# Altium schematic sheet EMG_biofedback.SchDoc
size A4
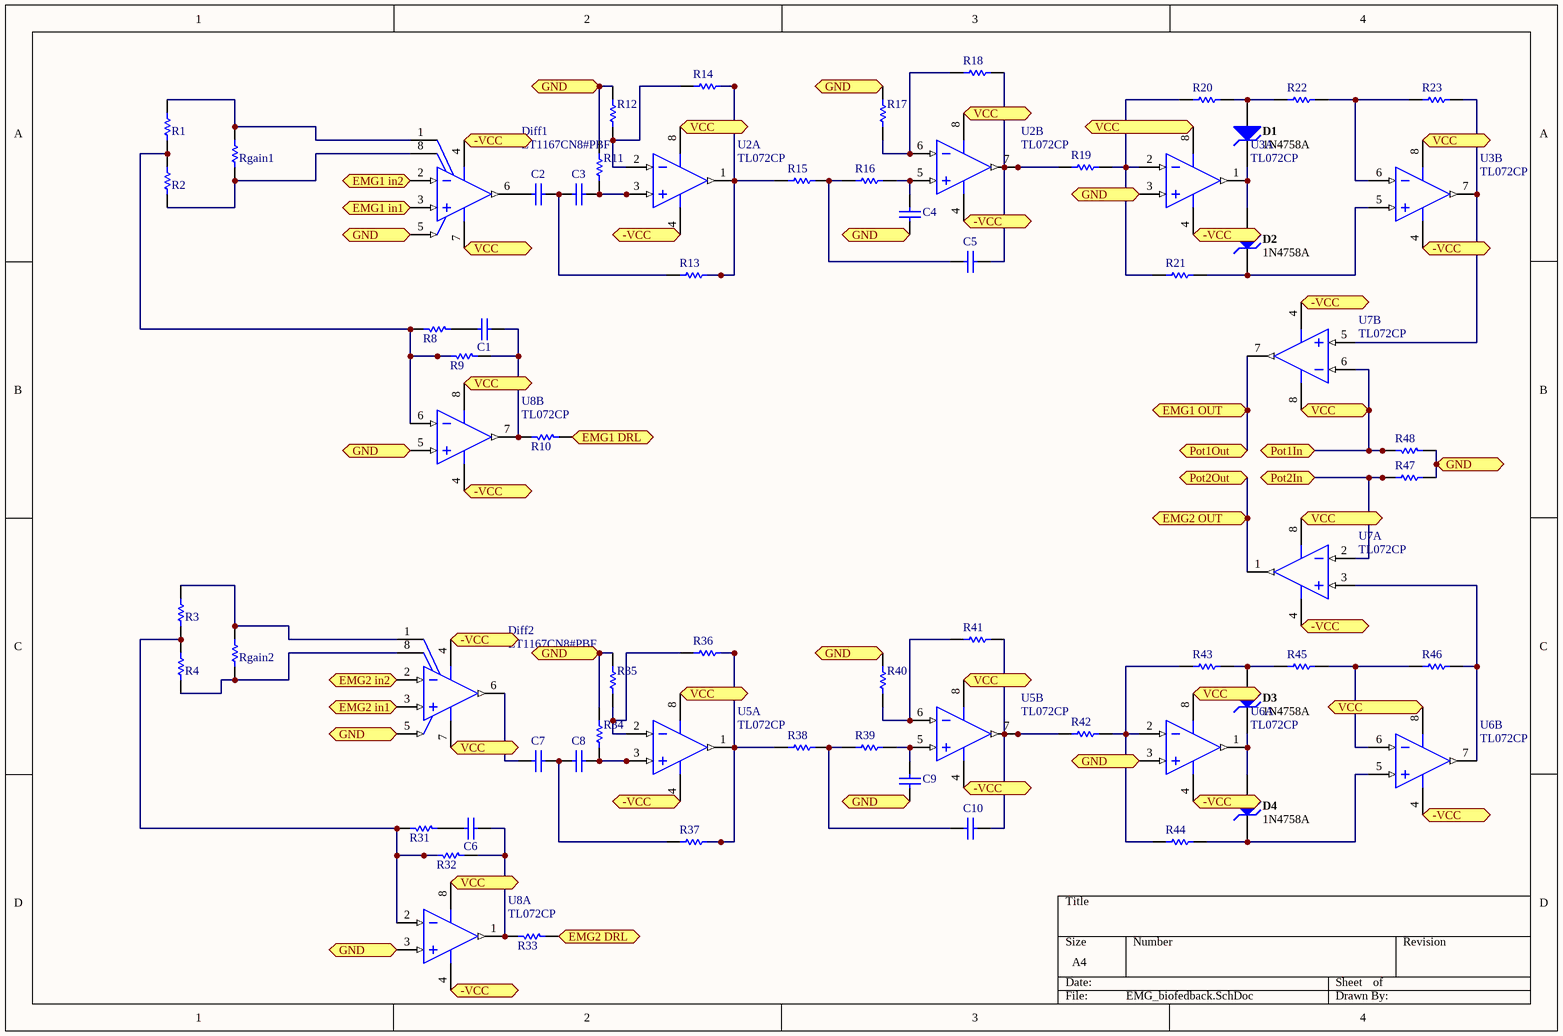
[diagram p0: EMG_biofedback.SchDoc]

## Parts
C1  CAP 10nF 50V 0805(2012)  [CAPC0805(2012)100_M]  (value not drawn)
C2  CAP 1uF 50V 0805(2012)  [CAPC0805(2012)145_L]  (value not drawn)
C3  CAP 1uF 50V 0805(2012)  [CAPC0805(2012)145_L]  (value not drawn)
C4  CAP 47nF 50V 0805(2012)  [CAPC0805(2012)145_M]  (value not drawn)
C5  CAP 4.7nF 50V 0805(2012)  [CAPC0805(2012)110_M]  (value not drawn)
C6  CAP 10nF 50V 0805(2012)  [CAPC0805(2012)100_M]  (value not drawn)
C7  CAP 1uF 50V 0805(2012)  [CAPC0805(2012)145_L]  (value not drawn)
C8  CAP 1uF 50V 0805(2012)  [CAPC0805(2012)145_L]  (value not drawn)
C9  CAP 47nF 50V 0805(2012)  [CAPC0805(2012)145_M]  (value not drawn)
C10  CAP 4.7nF 50V 0805(2012)  [CAPC0805(2012)110_M]  (value not drawn)
D1  1N4758A  [FAIR-DO-41-2_V]
D2  1N4758A  [FAIR-DO-41-2_V]
D3  1N4758A  [FAIR-DO-41-2_V]
D4  1N4758A  [FAIR-DO-41-2_V]
Diff1  LT1167CN8#PBF  [LT-N8-8]
Diff2  LT1167CN8#PBF  [LT-N8-8]
R1  30K 5% 0805(2012)  [RESC0805(2012)_M]  (value not drawn)
R2  30K 5% 0805(2012)  [RESC0805(2012)_M]  (value not drawn)
R3  30K 5% 0805(2012)  [RESC0805(2012)_M]  (value not drawn)
R4  30K 5% 0805(2012)  [RESC0805(2012)_M]  (value not drawn)
R8  12K 5% 0805(2012)  [RESC0805(2012)_N]  (value not drawn)
R9  1M 5% 0805(2012)  [RESC0805(2012)_L]  (value not drawn)
R10  1M 5% 0805(2012)  [RESC0805(2012)_L]  (value not drawn)
R11  6K2 5% 0805(2012)  [RESC0805(2012)_L]  (value not drawn)
R12  20K 5% 0805(2012)  [RESC0805(2012)_L]  (value not drawn)
R13  43K 5% 0805(2012)  [RESC0805(2012)_N]  (value not drawn)
R14  180K 5% 0805(2012)  [RESC0805(2012)_N]  (value not drawn)
R15  51K 5% 0805(2012)  [RESC0805(2012)_L]  (value not drawn)
R16  9K1 5% 0805(2012)  [RESC0805(2012)_M]  (value not drawn)
R17  20K 5% 0805(2012)  [RESC0805(2012)_L]  (value not drawn)
R18  180K 5% 0805(2012)  [RESC0805(2012)_N]  (value not drawn)
R19  10K 5% 0805(2012)  [RESC0805(2012)_L]  (value not drawn)
R20  10K 5% 0805(2012)  [RESC0805(2012)_L]  (value not drawn)
R21  10K 5% 0805(2012)  [RESC0805(2012)_L]  (value not drawn)
R22  10K 5% 0805(2012)  [RESC0805(2012)_L]  (value not drawn)
R23  10K 5% 0805(2012)  [RESC0805(2012)_L]  (value not drawn)
R31  12K 5% 0805(2012)  [RESC0805(2012)_N]  (value not drawn)
R32  1M 5% 0805(2012)  [RESC0805(2012)_L]  (value not drawn)
R33  1M 5% 0805(2012)  [RESC0805(2012)_L]  (value not drawn)
R34  6K2 5% 0805(2012)  [RESC0805(2012)_L]  (value not drawn)
R35  20K 5% 0805(2012)  [RESC0805(2012)_L]  (value not drawn)
R36  180K 5% 0805(2012)  [RESC0805(2012)_N]  (value not drawn)
R37  43K 5% 0805(2012)  [RESC0805(2012)_N]  (value not drawn)
R38  51K 5% 0805(2012)  [RESC0805(2012)_L]  (value not drawn)
R39  9K1 5% 0805(2012)  [RESC0805(2012)_M]  (value not drawn)
R40  20K 5% 0805(2012)  [RESC0805(2012)_L]  (value not drawn)
R41  180K 5% 0805(2012)  [RESC0805(2012)_N]  (value not drawn)
R42  10K 5% 0805(2012)  [RESC0805(2012)_L]  (value not drawn)
R43  10K 5% 0805(2012)  [RESC0805(2012)_L]  (value not drawn)
R44  10K 5% 0805(2012)  [RESC0805(2012)_L]  (value not drawn)
R45  10K 5% 0805(2012)  [RESC0805(2012)_L]  (value not drawn)
R46  10K 5% 0805(2012)  [RESC0805(2012)_L]  (value not drawn)
R47  10K 5% 0805(2012)  [RESC0805(2012)_L]  (value not drawn)
R48  10K 5% 0805(2012)  [RESC0805(2012)_L]  (value not drawn)
Rgain1  6K2 5% 0805(2012)  [RESC0805(2012)_L]  (value not drawn)
Rgain2  6K2 5% 0805(2012)  [RESC0805(2012)_L]  (value not drawn)
U2  TL072CP  [TI-P8]  (parts A,B of 2)
U3  TL072CP  [TI-P8]  (parts A,B of 2)
U5  TL072CP  [TI-P8]  (parts A,B of 2)
U6  TL072CP  [TI-P8]  (parts A,B of 2)
U7  TL072CP  [TI-P8]  (parts A,B of 2)
U8  TL072CP  [TI-P8]  (parts A,B of 2)

## Ports
-VCC, EMG1 DRL, EMG1 in1, EMG1 in2, EMG1 OUT, EMG2 DRL, EMG2 in1, EMG2 in2, EMG2 OUT, GND, Pot1In, Pot1Out, Pot2In, Pot2Out, VCC

## Nets
-VCC: Diff1.4(-VS) Diff2.4(-VS) U2.4(VCC-) U3.4(VCC-) U5.4(VCC-) U6.4(VCC-) U7.4(VCC-) U8.4(VCC-) ; port -VCC
EMG1 DRL: R10.1 ; port EMG1 DRL
EMG1 in1: Diff1.3(+IN) ; port EMG1 in1
EMG1 in2: Diff1.2(-IN) ; port EMG1 in2
EMG1 OUT: U7.7(OUT2) ; port EMG1 OUT, port Pot1Out
EMG2 DRL: R33.1 ; port EMG2 DRL
EMG2 in1: Diff2.3(+IN) ; port EMG2 in1
EMG2 in2: Diff2.2(-IN) ; port EMG2 in2
EMG2 OUT: U7.1(OUT1) ; port EMG2 OUT, port Pot2Out
GND: C4.1 C9.1 Diff1.5(REF) Diff2.5(REF) R11.1 R12.2 R17.2 R34.1 R35.2 R40.2 R47.2 R48.2 U3.3(IN1+) U6.3(IN1+) U8.3(IN1+) U8.5(IN2+) ; port GND
Pot1In: Diff1.7(+VS) Diff2.7(+VS) R48.1 U2.8(VCC+) U3.8(VCC+) U5.8(VCC+) U6.8(VCC+) U7.6(IN2-) U7.8(VCC+) U8.8(VCC+) ; port Pot1In, port VCC
Pot2In: R47.1 U7.2(IN1-) ; port Pot2In
NetC1_1: C1.1 R9.1 R10.2 U8.7(OUT2)
NetC1_2: C1.2 R8.2
NetC2_1: C2.1 Diff1.6(OUTPUT)
NetC2_2: C2.2 C3.1 R13.1
NetC3_2: C3.2 R11.2 U2.3(IN1+)
NetC4_2: C4.2 R16.2 U2.5(IN2+)
NetC5_1: C5.1 R15.2 R16.1
NetC5_2: C5.2 R18.2 R19.1 U2.7(OUT2)
NetC6_1: C6.1 R32.1 R33.2 U8.1(OUT1)
NetC6_2: C6.2 R31.2
NetC7_1: C7.1 Diff2.6(OUTPUT)
NetC7_2: C7.2 C8.1 R37.1
NetC8_2: C8.2 R34.2 U5.3(IN1+)
NetC9_2: C9.2 R39.2 U5.5(IN2+)
NetC10_1: C10.1 R38.2 R39.1
NetC10_2: C10.2 R41.2 R42.1 U5.7(OUT2)
NetD1_1: D1.1(A) R20.2 R22.1
NetD1_2: D1.2(K) D2.1(A) U3.1(OUT1)
NetD2_2: D2.2(K) R21.2 U3.5(IN2+)
NetD3_1: D3.1(A) R43.2 R45.1
NetD3_2: D3.2(K) D4.1(A) U6.1(OUT1)
NetD4_2: D4.2(K) R44.2 U6.5(IN2+)
NetDiff1_1: Diff1.1(RG) R1.2 Rgain1.2
NetDiff1_8: Diff1.8(RG) R2.1 Rgain1.1
NetDiff2_1: Diff2.1(RG) R3.2 Rgain2.2
NetDiff2_8: Diff2.8(RG) R4.1 Rgain2.1
NetR1_1: R1.1 R2.2 R8.1 R9.2 U8.6(IN2-)
NetR3_1: R3.1 R4.2 R31.1 R32.2 U8.2(IN1-)
NetR12_1: R12.1 R14.1 U2.2(IN1-)
NetR13_2: R13.2 R14.2 R15.1 U2.1(OUT1)
NetR17_1: R17.1 R18.1 U2.6(IN2-)
NetR19_2: R19.2 R20.1 R21.1 U3.2(IN1-)
NetR22_2: R22.2 R23.1 U3.6(IN2-)
NetR23_2: R23.2 U3.7(OUT2) U7.5(IN2+)
NetR35_1: R35.1 R36.1 U5.2(IN1-)
NetR36_2: R36.2 R37.2 R38.1 U5.1(OUT1)
NetR40_1: R40.1 R41.1 U5.6(IN2-)
NetR42_2: R42.2 R43.1 R44.1 U6.2(IN1-)
NetR45_2: R45.2 R46.1 U6.6(IN2-)
NetR46_2: R46.2 U6.7(OUT2) U7.3(IN1+)

## Library data of the parts
C1 C6 = CMP-1036-03837-1: CAP 10nF 50V ±1% 0805 (2012 Metric) Thickness 1mm SMD; Case-Metric: 2012; Case-EIA: 0805; Tolerance: ±1%; Rated Voltage: 50 V; Value: 10nF; Max Thickness: 1 mm; Technology: SMT
C2 C3 C7 C8 = CMP-1036-04761-1: CAP 1uF 50V ±10% 0805 (2012 Metric) Thickness 1.45mm SMD; Case-EIA: 0805; Case-Metric: 2012; Technology: SMT; Tolerance: ±10%; Value: 1uF; Max Thickness: 1.45 mm; Rated Voltage: 50 V
C4 C9 = CMP-1036-04255-1: CAP 47nF 50V ±5% 0805 (2012 Metric) Thickness 1.45mm SMD; Case-EIA: 0805; Case-Metric: 2012; Max Thickness: 1.45 mm; Rated Voltage: 50 V; Tolerance: ±5%; Technology: SMT; Value: 47nF
C5 C10 = CMP-1036-03592-1: CAP 4.7nF 50V ±10% 0805 (2012 Metric) Thickness 1.1mm SMD; Case-Metric: 2012; Case-EIA: 0805; Max Thickness: 1.1 mm; Value: 4.7nF; Tolerance: ±10%; Rated Voltage: 50 V; Technology: SMT
D1-D4 = CMP-0892-00017-1: Zener Diode, 56V, 1W, 5%, -65 to 200 degC, 2-Pin DO-41, Body 2.72 x 5.2 mm, RoHS; Manufacturer: Fairchild Semiconductor; IR (uA): 5; VZ (Max.) (V): 58.8; VZ (Min.) (V): 53.2; PD (W): 1; ZZ (Max) (ohm): 110; Test Current IZ (mA): 4.5; PartNumber: 1N4758A; Tolerance: 5%; Mounting Technology: Through Hole; ComponentLink2URL: http://www.fairchildsemi.com/ds/1N/1N4744A.pdf; ComponentLink2Description: Datasheet; PackageDescription: 2-Pin Axial leaded, Body 2.72 x 5.2 mm, Lead Spread 25.4 mm; PackageVersion: Rev. 2; ComponentLink3Description: Package Specification; RoHS: TRUE; ComponentLink1Description: Manufacturer URL; DatasheetVersion: Rev. H3; ComponentLink1URL: http://www.fairchildsemi.com/; ComponentLink3URL: http://www.fairchildsemi.com/dwg/DO/DO41A.pdf; Operating and Storage Temperature Range: -65 to 200 degC; PackageReference: DO-41-2
Diff1 Diff2 = CMP-0359-01174-1: Single Channel, Precision Operational Amplifier, Low Bias Current IA, 1 MHz Typical GBW, 1.2 V/us Typical SR, 4.6 to 40 V, 8-Pin DIP (N8-8), Commercial, Pb-Free; Manufacturer: Linear Technology; Linear Technology Part Number: LT1167; GBW (MHz) Typical: 1; Vs Min (V): 4.6; Is (mA) Typical: 0.9; Vos (mV) Typical: 0.015; SR (V/us) Typical: 1.2; Vs Max (V): 40; Mounting Technology: Surface Mount; ComponentLink1Description: Datasheet; Type: IA; ComponentLink1URL: http://cds.linear.com/docs/Datasheet/1167fc.pdf; PackageVersion: Rev I; ComponentLink2Description: Package Specification; PackageDescription: 8-Lead PDIP, Body 10.16 x 6.48 mm, Pitch 2.54 mm; RoHS: Pb-Free; ComponentLink2URL: http://cds.linear.com/docs/Packaging/05081510_I_N8.pdf; PartNumber: LT1167CN8#PBF; Channels (#): 1; DatasheetVersion: Rev. C; PackageReference: LT-N8-8
R1-R4 = CMP-1013-00109-1: 30K 0.125W 5% 0805 (2012 Metric)  SMD; Case-EIA: 0805; Case-Metric: 2012; Value: 30000.00 Ohm; Tolerance: 5 %; Technology: SMT; Power: 0.125 W
R8 R31 = CMP-1013-00100-1: 12K 0.125W 5% 0805 (2012 Metric)  SMD; Value: 12000.00 Ohm; Case-Metric: 2012; Case-EIA: 0805; Power: 0.125 W; Technology: SMT; Tolerance: 5 %
R9 R10 R32 R33 = CMP-1013-00146-1: 1M 0.125W 5% 0805 (2012 Metric)  SMD; Case-Metric: 2012; Value: 1000000.00 Ohm; Case-EIA: 0805; Technology: SMT; Tolerance: 5 %; Power: 0.125 W
R11 R34 Rgain1 Rgain2 = CMP-1013-00093-1: 6K2 0.125W 5% 0805 (2012 Metric)  SMD; Case-EIA: 0805; Value: 6200.00 Ohm; Case-Metric: 2012; Tolerance: 5 %; Technology: SMT; Power: 0.125 W
R12 R17 R35 R40 = CMP-1013-00105-1: 20K 0.125W 5% 0805 (2012 Metric)  SMD; Case-Metric: 2012; Case-EIA: 0805; Value: 20000.00 Ohm; Technology: SMT; Power: 0.125 W; Tolerance: 5 %
R13 R37 = CMP-1013-00113-1: 43K 0.125W 5% 0805 (2012 Metric)  SMD; Case-EIA: 0805; Case-Metric: 2012; Value: 43000.00 Ohm; Power: 0.125 W; Tolerance: 5 %; Technology: SMT
R14 R18 R36 R41 = CMP-1013-00128-1: 180K 0.125W 5% 0805 (2012 Metric)  SMD; Value: 180000.00 Ohm; Case-EIA: 0805; Case-Metric: 2012; Technology: SMT; Tolerance: 5 %; Power: 0.125 W
R15 R38 = CMP-1013-00115-1: 51K 0.125W 5% 0805 (2012 Metric)  SMD; Case-Metric: 2012; Value: 51000.00 Ohm; Case-EIA: 0805; Technology: SMT; Power: 0.125 W; Tolerance: 5 %
R16 R39 = CMP-1013-00097-1: 9K1 0.125W 5% 0805 (2012 Metric)  SMD; Case-EIA: 0805; Case-Metric: 2012; Value: 9100.00 Ohm; Technology: SMT; Tolerance: 5 %; Power: 0.125 W
R19-R23 R42-R48 = CMP-1013-00098-1: 10K 0.125W 5% 0805 (2012 Metric)  SMD; Case-EIA: 0805; Case-Metric: 2012; Value: 10000.00 Ohm; Power: 0.125 W; Technology: SMT; Tolerance: 5 %
U2 U3 U5-U8 = CMP-0017-00950-1: Dual Low-Noise JFET-Input General-Purpose Operational Amplifier, 7 to 36 V, 0 to 70 degC, 8-pin DIP (P8), Pb-Free (RoHS); Manufacturer: Texas Instruments; Offset Drift(Typ)(uV/C): 18; Total Supply Voltage(Min)(+5V is 5, +/-5V is 10): 7; Sub Family: General Purpose Amplifier, High Supply Voltage Amplifier (>=30V); IIB(Max)(pA): 200; Total Supply Voltage(Max)(+5V is 5, +/-5V is 10): 36; Rating: Catalog; GBW(Typ)(MHz): 3; CMRR(Min)(dB): 70; Slew Rate(Typ)(V/us): 13; Number of Channels: 2; Iq per channel(Max)(mA): 2.5; Vio (25C)(Max)(mV): 10; Vn at 1kHz(Typ)(nV/rtHz): 18; ComponentLink1Description: Manufacturer URL; Eco-Plan: Pb-Free (RoHS); PackageReference: P8; Mounting Technology: Through Hole; PartNumber: TL072CP; ComponentLink2Description: Datasheet; DatasheetVersion: SLOS080J; ComponentLink1URL: http://www.ti.com/; ComponentLink3Description: Package Specification; PackageDescription: 8-Pin Plastic In-Line, Body 9.59 x 6.35 mm, Pitch 2.54 mm; ComponentLink2URL: http://www.ti.com/lit/ds/symlink/tl072.pdf; Code_JEDEC: MS-001; ComponentLink3URL: http://www.ti.com/litv/pdf/mpdi001b; PackageVersion: 4040082/E, 04/2010